# EAGLE design transmission end copy-1 (EAGLE 6.3)
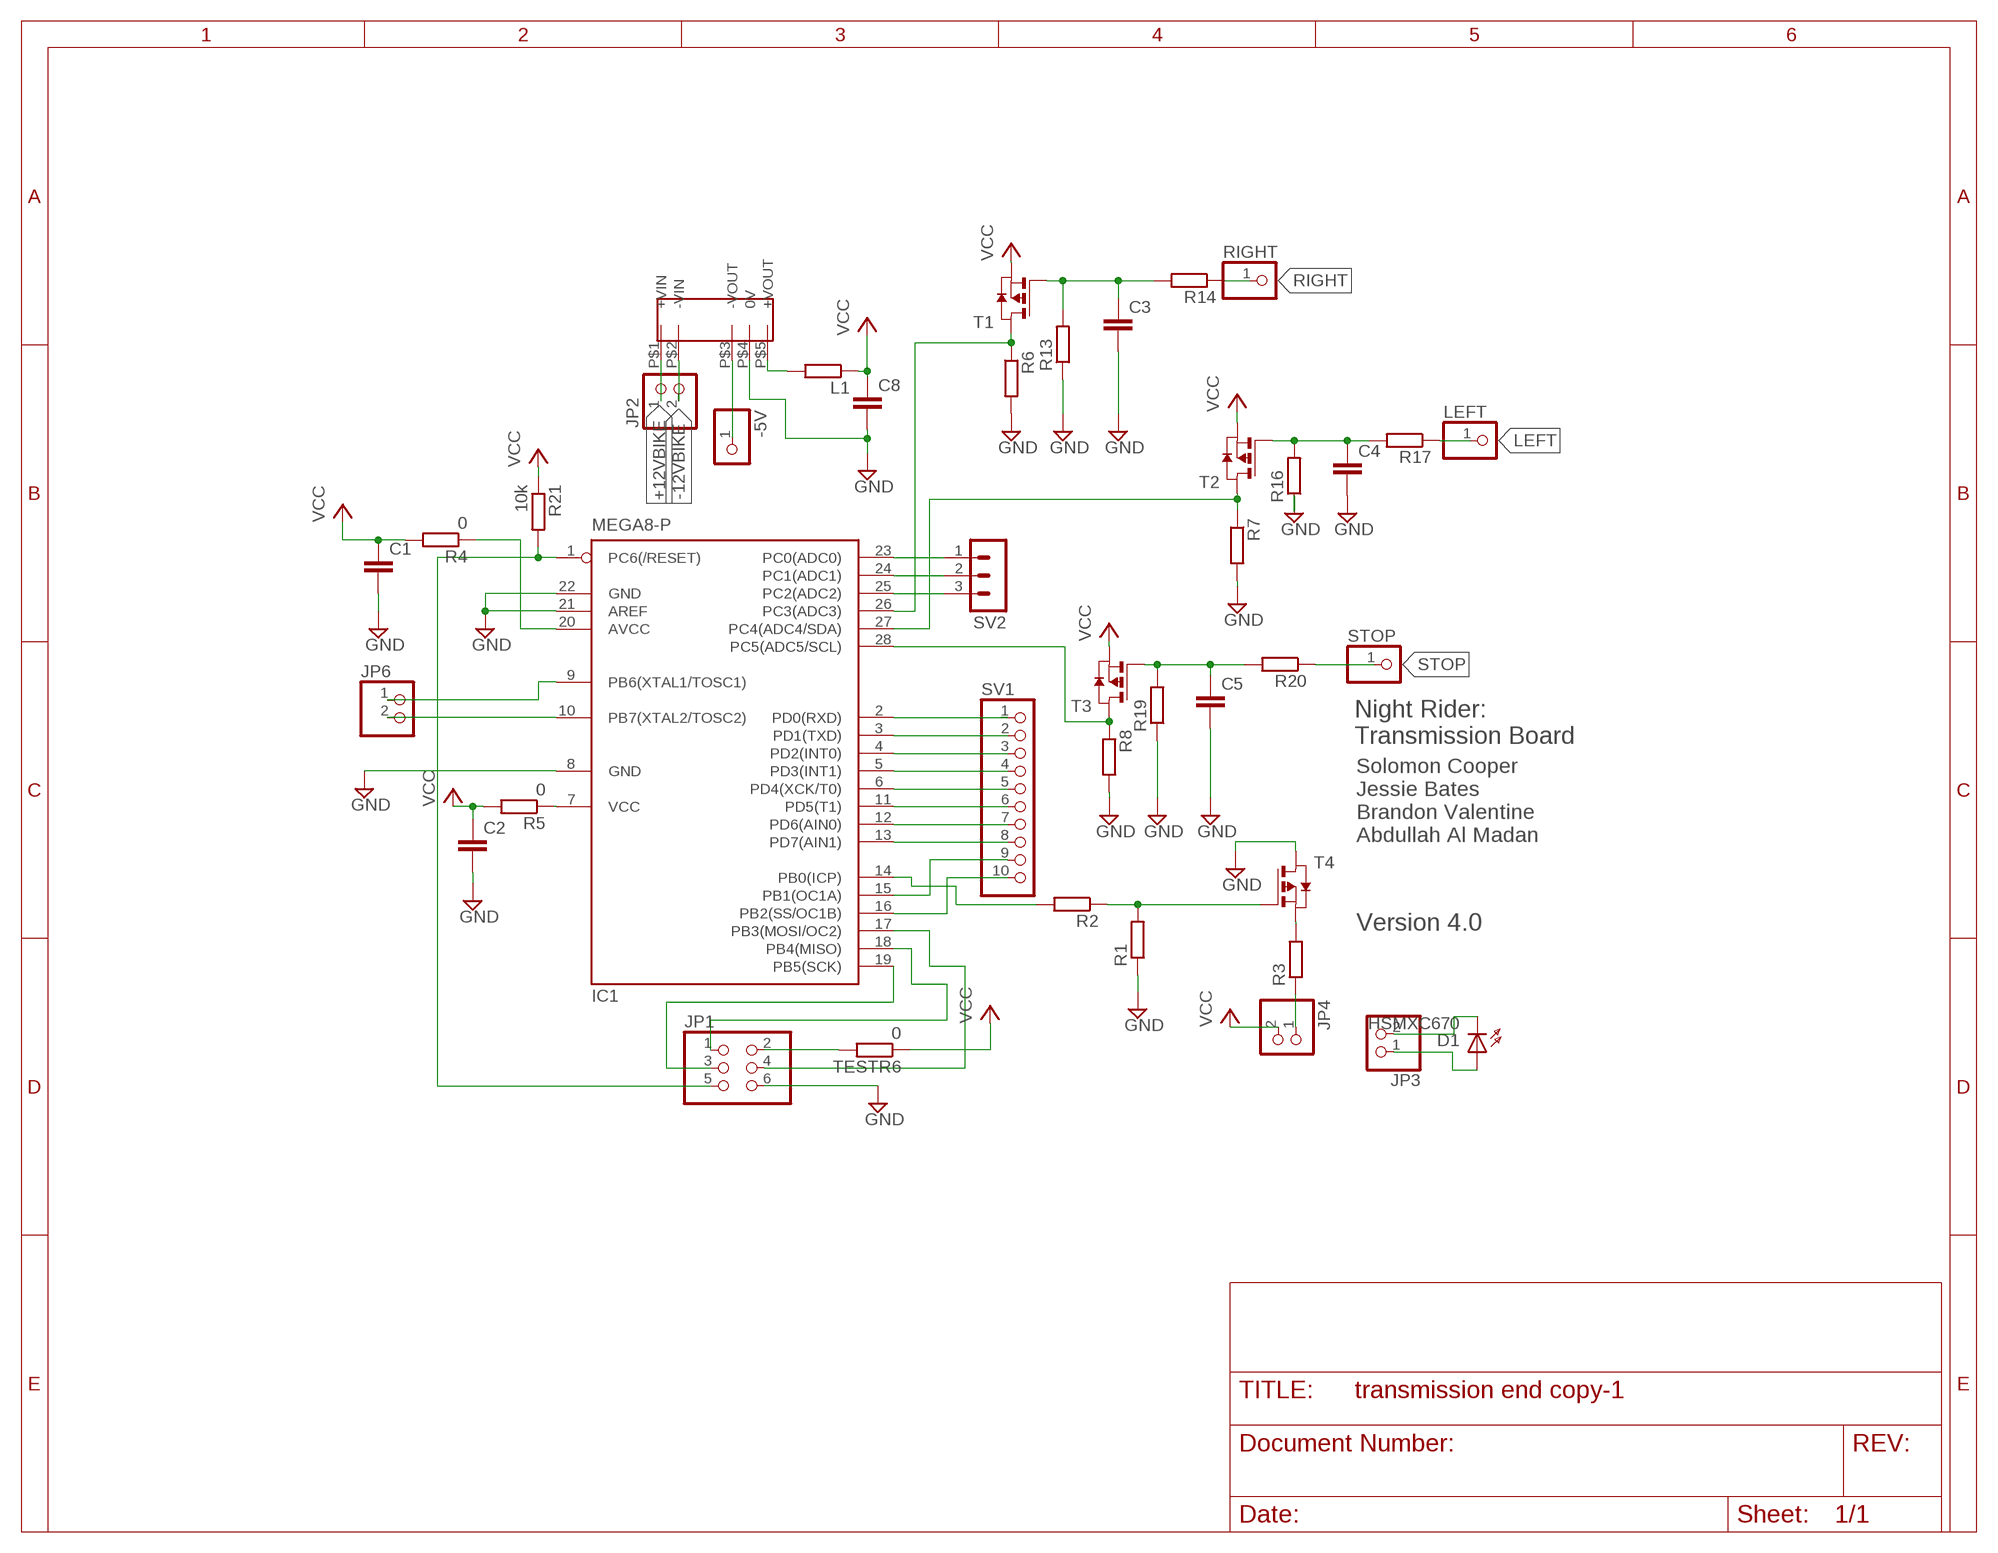
[diagram p0: schematic, sheet 1]

## Parts
-5V  PINHD-1X1  [1X01]
C1  C-EUC0805  [C0805]
C2  C-EUC0805  [C0805]
C3  C-EUC0805  [C0805]
C4  C-EUC0805  [C0805]
C5  C-EUC0805  [C0805]
C8  C-EUC0805  [C0805]
D1  HSMXC670  [HSMXC670]
IC1  MEGA8-P  [DIL28-3]
JP1  PINHD-2X3  [2X03]
JP2  PINHD-1X2  [1X02]
JP3  PINHD-1X2  [1X02]
JP4  PINHD-1X2  [1X02]
JP6  PINHD-1X2  [1X02]
L1  R-EU_M0805  [M0805]
LEFT  PINHD-1X1  [1X01]
R1  R-EU_M0805  [M0805]
R2  R-EU_M0805  [M0805]
R3  R-EU_M0805  [M0805]
R4  0  R-EU_M0805  [M0805]
R5  0  R-EU_M0805  [M0805]
R6  R-EU_M0805  [M0805]
R7  R-EU_M0805  [M0805]
R8  R-EU_M0805  [M0805]
R13  R-EU_M0805  [M0805]
R14  R-EU_M0805  [M0805]
R16  R-EU_M0805  [M0805]
R17  R-EU_M0805  [M0805]
R19  R-EU_M0805  [M0805]
R20  R-EU_M0805  [M0805]
R21  10k  R-EU_M0805  [M0805]
RIGHT  PINHD-1X1  [1X01]
STOP  PINHD-1X1  [1X01]
SV1  PINHD-1X10  [1X10]
SV2  MA03-1  [MA03-1]
T1  PMOSSOT23  [SOT-23]
T2  PMOSSOT23  [SOT-23]
T3  PMOSSOT23  [SOT-23]
T4  PMOSSOT23  [SOT-23]
TESTR6  0  R-EU_M0805  [M0805]
U$1  NKA1205SC  [NKA1205SC]

## Nets
+12VBIKE: JP2.1 U$1.P$1(+VIN)
-12VBIKE: JP2.2 U$1.P$2(-VIN)
GND: C1.2 C2.2 C3.2 C4.2 C5.2 C8.2 IC1.8(GND) IC1.21(AREF) IC1.22(GND) JP1.6 R1.1 R6.2 R7.2 R8.2 R13.1 R16.1 R19.1 T4.1(D) U$1.P$4(0V)
LEFT: LEFT.1 R17.1
N$1: IC1.2(PD0(RXD)) SV1.1
N$2: R1.2 R2.1 T4.3(G)
N$3: JP4.1 R3.1
N$4: IC1.27(PC4(ADC4/SDA)) R7.1 T2.1(D)
N$5: IC1.3(PD1(TXD)) SV1.2
N$6: R3.2 T4.2(S)
N$7: IC1.1(PC6(/RESET)) JP1.5 R21.2
N$8: IC1.14(PB0(ICP)) R2.2
N$9: L1.2 U$1.P$5(+VOUT)
N$10: IC1.4(PD2(INT0)) SV1.3
N$11: -5V.1 U$1.P$3(-VOUT)
N$12: IC1.9(PB6(XTAL1/TOSC1)) JP6.1
N$14: IC1.28(PC5(ADC5/SCL)) R8.1 T3.1(D)
N$15: IC1.5(PD3(INT1)) SV1.4
N$16: IC1.6(PD4(XCK/T0)) SV1.5
N$17: IC1.11(PD5(T1)) SV1.6
N$18: IC1.12(PD6(AIN0)) SV1.7
N$19: IC1.13(PD7(AIN1)) SV1.8
N$20: D1.K(C) JP3.2
N$21: IC1.15(PB1(OC1A)) SV1.9
N$22: IC1.16(PB2(SS/OC1B)) SV1.10
N$23: IC1.17(PB3(MOSI/OC2)) JP1.4
N$24: IC1.18(PB4(MISO)) JP1.1
N$25: IC1.19(PB5(SCK)) JP1.3
N$26: IC1.10(PB7(XTAL2/TOSC2)) JP6.2
N$27: IC1.23(PC0(ADC0)) SV2.1
N$28: IC1.24(PC1(ADC1)) SV2.2
N$29: IC1.25(PC2(ADC2)) SV2.3
N$30: IC1.26(PC3(ADC3)) R6.1 T1.1(D)
N$31: IC1.7(VCC) R5.1
N$32: IC1.20(AVCC) R4.1
N$33: JP1.2 TESTR6.2
N$34: C4.1 R16.2 R17.2 T2.3(G)
N$35: C3.1 R13.2 R14.2 T1.3(G)
N$36: D1.A JP3.1
N$37: C5.1 R19.2 R20.2 T3.3(G)
RIGHT: R14.1 RIGHT.1
STOP: R20.1 STOP.1
VCC: C1.1 C2.1 C8.1 JP4.2 L1.1 R4.2 R5.2 R21.1 T1.2(S) T2.2(S) T3.2(S) TESTR6.1

## Notes on the sheet
- Night Rider: 
  Transmission Board
- Solomon Cooper 
  Jessie Bates
  Brandon Valentine
  Abdullah Al Madan
- Version 4.0

## Library data of the parts
-5V LEFT RIGHT STOP = pinhead:PINHD-1X1: PIN HEADER
C1-C5 C8 = rcl:C-EU: CAPACITOR, European symbol
D1 = opto-transmittter-hp:HSMXC670: OPTO TRANSMITTER; OC_FARNELL: unknown; OC_NEWARK: unknown
IC1 = atmel:MEGA8-P: MICROCONTROLLER 8 Kbytes FLASH, 1 kbytes SRAM, 512 bytes EEPROM, USART, 4-channel 10 bit ADC, 2-channel 8 bit ADC Pin compatible with Atmega48, ATMega88, ATMega168 Source: avr.lbr; OC_FARNELL: unknown; OC_NEWARK: unknown
JP1 = pinhead:PINHD-2X3: PIN HEADER
JP2-JP4 JP6 = pinhead:PINHD-1X2: PIN HEADER
L1 R1-R8 R13 R14 R16 R17 R19-R21 TESTR6 = resistor:R-EU_: RESISTOR, European symbol
SV1 = pinhead:PINHD-1X10: PIN HEADER
SV2 = con-lstb:MA03-1: PIN HEADER; OC_FARNELL: unknown; OC_NEWARK: unknown
T1-T4 = zetex:PMOSSOT23: MOS FET; OC_FARNELL: unknown; OC_NEWARK: unknown
U$1 = nka1205sc:NKA1205SC

## Board
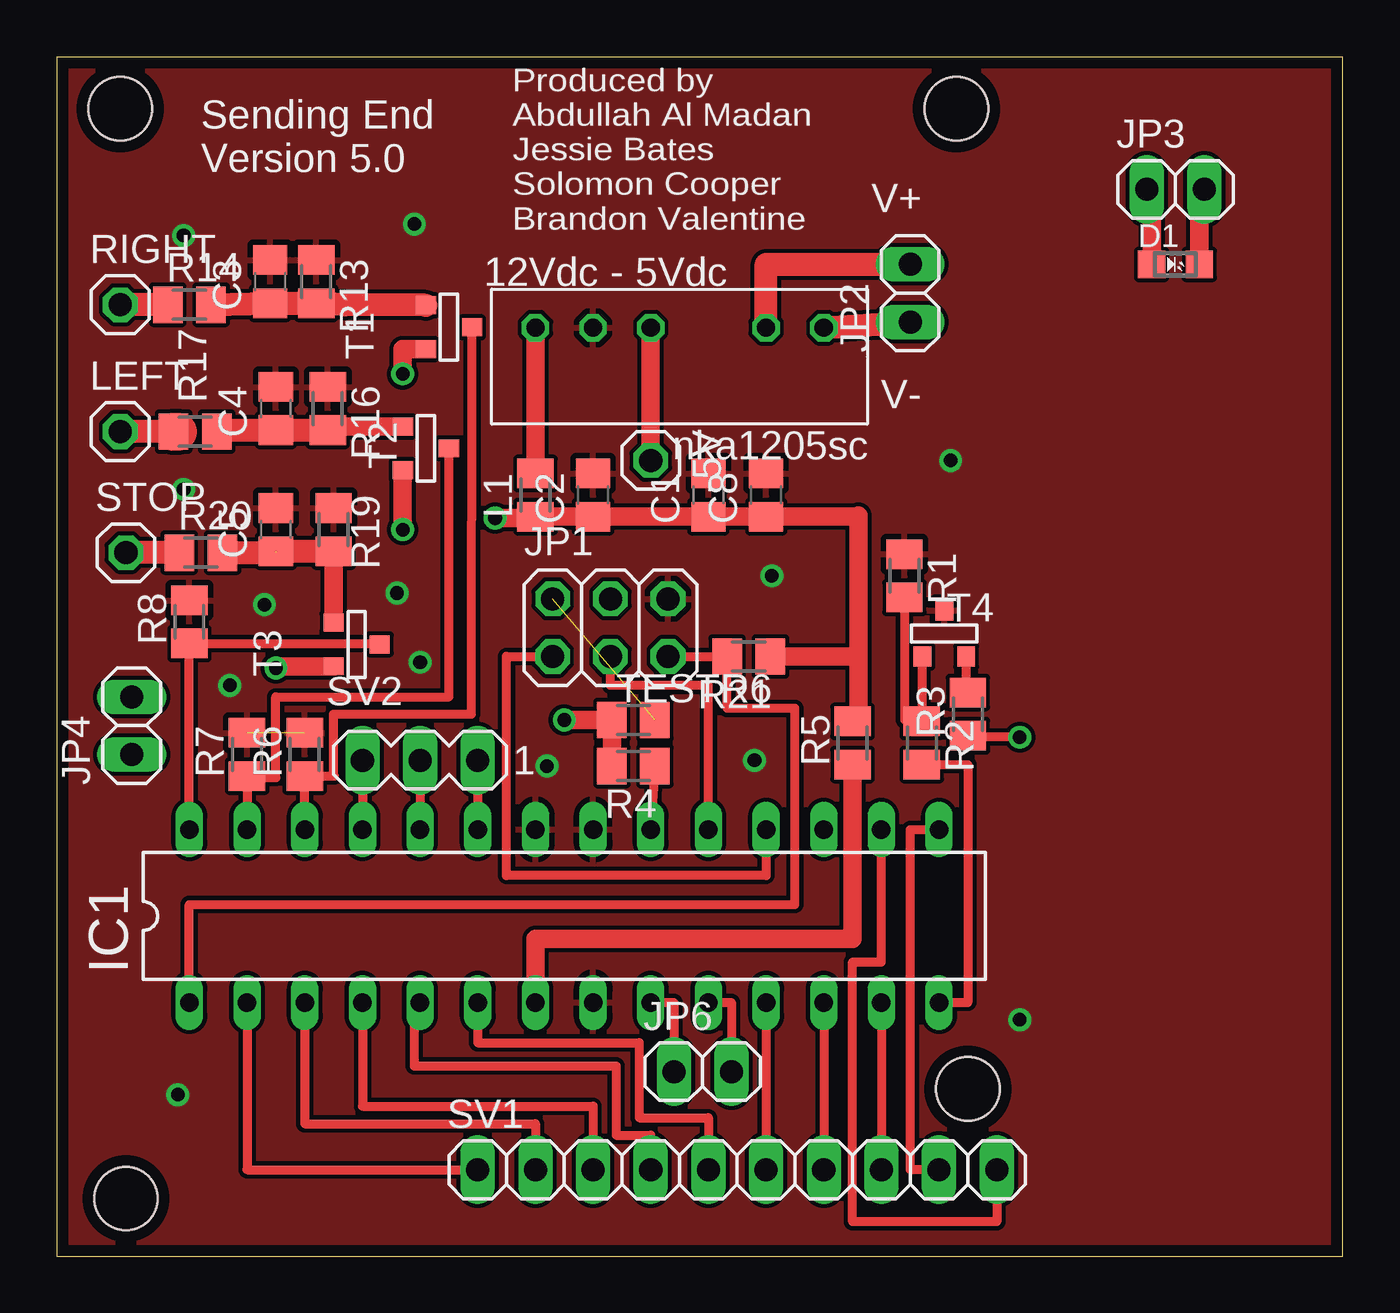
[diagram p1: board, top side]
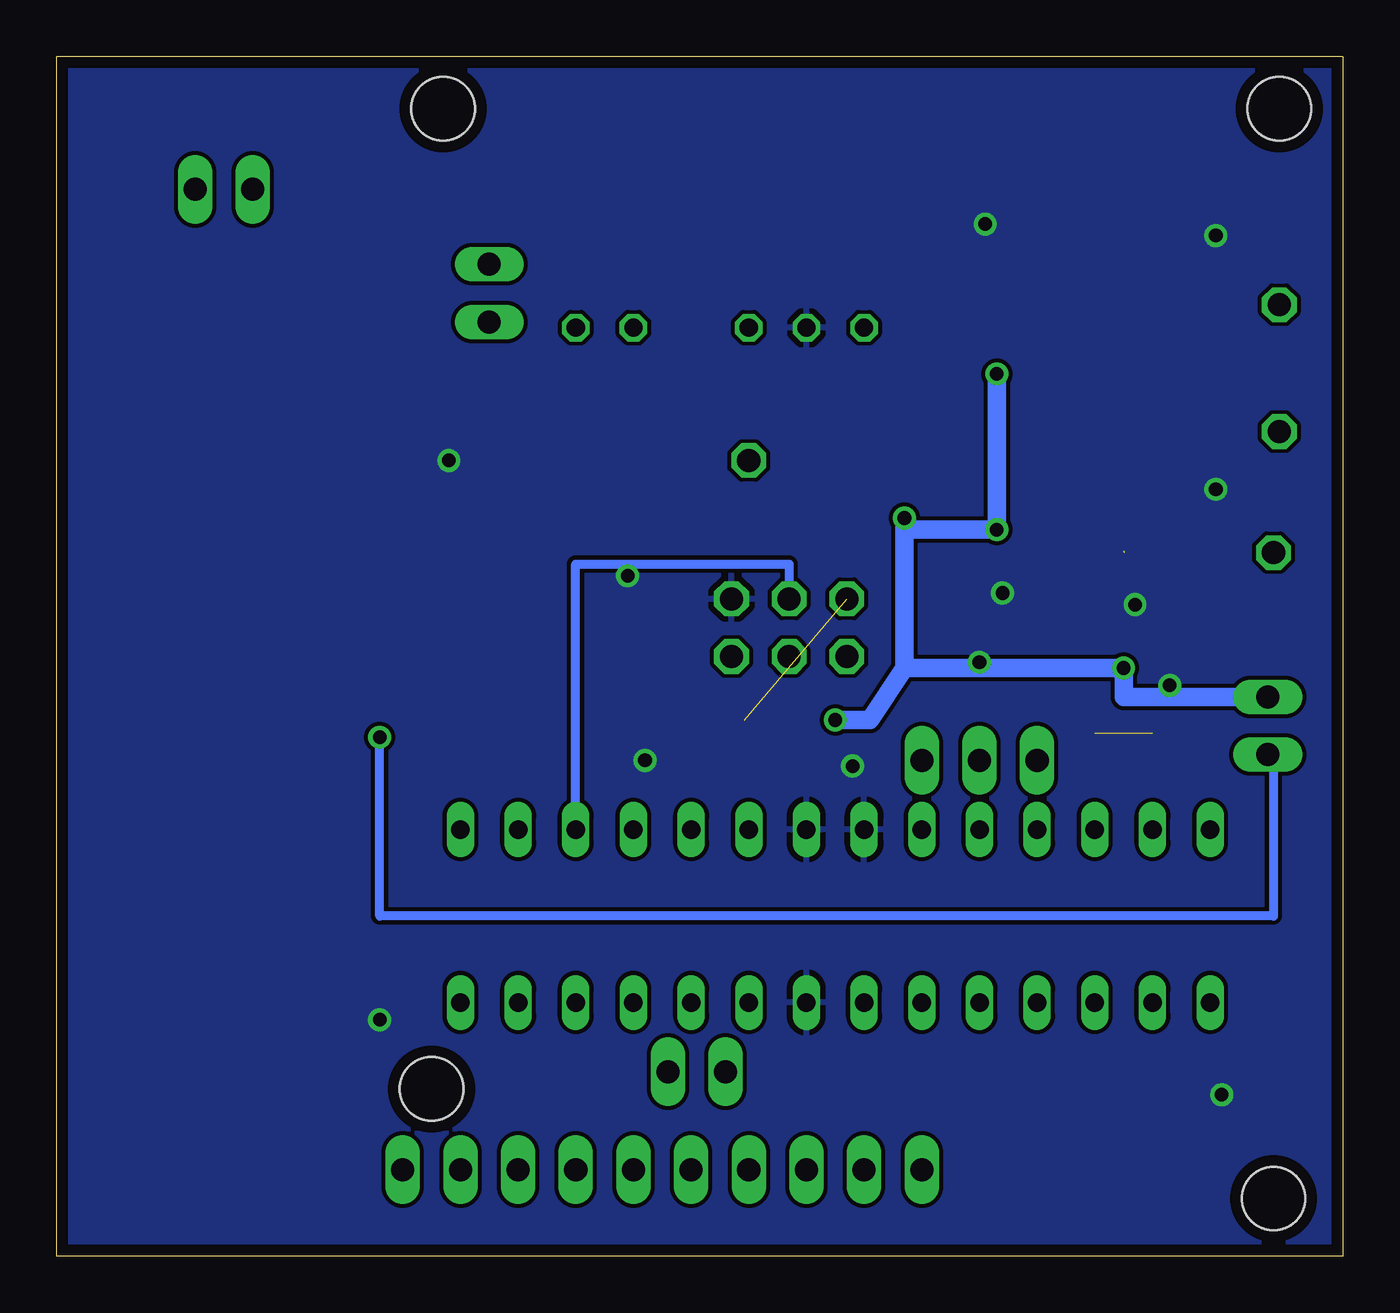
[diagram p2: board, bottom side, seen from below]

Size 56.64 x 52.83 mm. Coordinates in mm from the lower left corner, seen from the top.
Outline: 0,0 56.64,0 56.64,52.83 0,52.83 0,0
Copper layers (1*16): Top 0.0178mm / dielectric 59mil / Bottom 0.0178mm
Design rules "sunstone-valueproto": minimum track width 7mil, minimum drill 16mil, track to track 7mil, track to pad 7mil, pad to pad 7mil, via to via 7mil, smd to smd 7mil, copper to edge 20mil, drill to drill 16mil, minimum pad ring 8mil, minimum via ring 8mil, stop-mask expansion 3mil, vias tented up to drill 0mil, thermal gap 10mil
Holes 2.8 mm at 2.79,50.55 39.62,50.55 40.13,7.37 3.05,2.54

### Footprints (pad centres in the part's own frame; a part is rotated, then mirrored left to right if it is on the bottom)
1X01 = drill 1.016 octagon: 1 0,0
C0805 = smd 1.3 x 1.5: 1 -0.95,0; 2 0.95,0
HSMXC670 = smd 1.2 x 1.2: A -1.05,0; K 1.05,0
DIL28-3 = drill 0.813 long: 1 -16.51,-3.81; 2 -13.97,-3.81; 3 -11.43,-3.81; 4 -8.89,-3.81; 5 -6.35,-3.81; 6 -3.81,-3.81; 7 -1.27,-3.81; 8 1.27,-3.81; 9 3.81,-3.81; 10 6.35,-3.81; 11 8.89,-3.81; 12 11.43,-3.81; 13 13.97,-3.81; 14 16.51,-3.81; 15 16.51,3.81; 16 13.97,3.81; 17 11.43,3.81; 18 8.89,3.81; 19 6.35,3.81; 20 3.81,3.81; 21 1.27,3.81; 22 -1.27,3.81; 23 -3.81,3.81; 24 -6.35,3.81; 25 -8.89,3.81; 26 -11.43,3.81; 27 -13.97,3.81; 28 -16.51,3.81
2X03 = drill 1.016 octagon: 1 -2.54,-1.27; 2 -2.54,1.27; 3 0,-1.27; 4 0,1.27; 5 2.54,-1.27; 6 2.54,1.27
1X02 = drill 1.016 long: 1 -1.27,0; 2 1.27,0
M0805 = smd 1.3 x 1.6: 1 -0.95,0; 2 0.95,0
1X10 = drill 1.016 long: 1 -11.43,0; 2 -8.89,0; 3 -6.35,0; 4 -3.81,0; 5 -1.27,0; 6 1.27,0; 7 3.81,0; 8 6.35,0; 9 8.89,0; 10 11.43,0
MA03-1 = drill 1.016 long: 1 -2.54,0; 2 0,0; 3 2.54,0
SOT-23 = smd 0.787 x 0.889: 1 0.025,-1.016; 2 -0.94,1.016; 3 0.991,1.016
NKA1205SC = drill 0.8 octagon: P$1 -6.35,-1.27; P$2 -3.81,-1.27; P$3 1.27,-1.27; P$4 3.81,-1.27; P$5 6.35,-1.27

### Placement (x,y rotation side)
-5V  26.16,35.05 270 top
C1  28.7,33.53 90 top
C2  23.62,33.53 90 top
C3  9.4,42.93 90 top
C4  9.65,37.34 90 top
C5  9.65,32 90 top
C8  31.24,33.53 90 top
D1  49.28,43.69 0 top
IC1  22.35,14.99 0 top
JP1  24.38,27.69 0 top
JP2  37.59,42.42 90 top
JP3  49.28,46.99 0 top
JP4  3.3,23.37 90 top
JP6  28.45,8.13 0 top
L1  21.08,33.53 90 top
LEFT  2.79,36.32 0 top
R1  37.34,29.97 270 top
R2  38.1,22.61 270 top
R3  40.13,23.88 90 top
R4  25.4,21.59 180 top
R5  35.05,22.61 90 top
R6  10.92,22.1 90 top
R7  8.38,22.1 90 top
R8  5.84,27.94 90 top
R13  11.43,42.93 270 top
R14  5.84,41.91 0 top
R16  11.94,37.34 270 top
R17  6.1,36.32 0 top
R19  12.19,32 270 top
R20  6.35,30.99 0 top
R21  30.48,26.42 180 top
RIGHT  2.79,41.91 0 top
STOP  3.05,30.99 0 top
SV1  29.97,3.81 0 top
SV2  16,21.84 180 top
T1  17.27,40.89 90 top
T2  16.26,35.56 90 top
T3  13.21,26.92 90 top
T4  39.12,27.43 180 top
TESTR6  25.4,23.62 0 top
U$1  27.43,39.62 180 top

### Tracks (layer width: path | path; a pad name or v marks a point on that pad's centre or on a via)
+12VBIKE
  Top 1.016: U$1.P$1 JP2.1
-12VBIKE
  Top 1.016: U$1.P$2 31.24,43.69 JP2.2
GND  (via drill 0.6)  (1 unrouted)
  other vias: 15.75,45.47 14.99,29.21 9.14,28.7 31.5,29.97 39.37,35.05 5.33,7.11 30.73,21.84 21.59,21.59 16,26.16 42.42,10.41 7.62,25.15 5.59,33.78 5.59,44.96
  pour Bottom: 0,0 56.64,0 56.64,52.83 0,52.83
  pour Top: 0,0 56.64,0 56.64,52.83 0,52.83
LEFT
  Top 1.016: R17.1 LEFT.1
  Top 1.676: R17.1 5.33,36.32
N$1
  Top 0.406: IC1.2 8.38,3.81 SV1.1
N$2
  Top 0.406: T4.3 38.1,26.42 R2.1 38.1,23.62 37.34,23.62 R1.2
N$3  (via drill 0.6)
  Top 0.406: v42.42,22.86 40.13,22.86 R3.1
  Bottom 0.406: JP4.1 3.05,22.1 3.05,14.99 42.42,14.99 v42.42,22.86
N$4
  Top 0.406: IC1.27 R7.1 8.45,21.08 9.65,21.08 9.65,24.64 17.27,24.64 T2.1
N$5
  Top 0.406: IC1.3 10.92,5.84 21.08,5.84 SV1.2
N$6
  Top 0.406: R3.2 40.06,24.83 T4.2
N$7
  Top 0.406: JP1.5 R21.2 29.53,24.13 32.51,24.13 32.51,15.49 5.84,15.49 IC1.1
N$8
  Top 0.406: IC1.14 40.13,11.18 40.13,21.66 R2.2
N$9
  Top 0.813: U$1.P$5 L1.2
N$10
  Top 0.406: IC1.4 13.46,6.6 23.62,6.6 SV1.3
N$11
  Top 0.813: U$1.P$3 -5V.1
N$12
  Top 0.406: IC1.9 27.18,11.18 JP6.1
N$14
  Top 0.406: IC1.28 R8.1 14.22,26.99 T3.1
N$15
  Top 0.406: IC1.5 15.75,11.18 15.75,8.38 24.64,8.38 24.64,5.33 26.16,5.33 SV1.4
N$16
  Top 0.406: IC1.6 18.54,9.4 25.65,9.4 25.65,6.1 28.7,6.1 SV1.5
N$17
  Top 0.406: IC1.11 SV1.6
N$18
  Top 0.406: IC1.12 SV1.7
N$19
  Top 0.406: IC1.13 SV1.8
N$20
  Top 0.813: JP3.2 50.33,46.99 D1.K
N$21
  Top 0.406: SV1.9 37.59,3.81 37.59,18.8 IC1.15
N$22
  Top 0.406: SV1.10 41.4,1.52 35.05,1.52 35.05,12.95 36.32,12.95 IC1.16
N$23
  Bottom 0.406: IC1.17 33.78,30.48 24.38,30.48 JP1.4
N$24
  Top 0.406: IC1.18 31.24,16.76 19.81,16.76 19.81,26.42 JP1.1
N$25
  Top 0.406: IC1.19 28.7,25.15 24.38,25.15 JP1.3
N$26
  Top 0.406: IC1.10 29.72,11.18 JP6.2
N$27
  Top 0.406: SV2.1 IC1.23
N$28
  Top 0.406: SV2.2 IC1.24
N$29
  Top 0.406: SV2.3 IC1.25
N$30
  Top 0.406: IC1.26 R6.1 12.19,21.15 | 12.22,21.15 12.19,21.15 | 12.19,21.15 12.19,23.88 18.26,23.88 T1.1
N$31
  Top 0.813: IC1.7 21.08,13.97 35.05,13.97 R5.1
N$32
  Top 0.406: R4.1 IC1.20
N$33  (1 unrouted)
N$34
  Top 0.406: R17.2 7.11,36.39
  Top 0.813: T2.3 11.94,36.55 R16.2
  Top 1.016: 7.11,36.39 C4.1 R16.2
N$35
  Top 1.016: R14.2 C3.1 R13.2 12.7,41.91 T1.3
N$36
  Top 0.813: JP3.1 48.26,47.24 48.23,47.24 D1.A
N$37  (1 unrouted)
  Top 0.813: T3.3 R19.2
  Top 1.016: R20.2 9.65,30.99 | C5.1 R19.2
RIGHT
  Top 1.016: R14.1 RIGHT.1
STOP
  Top 1.016: R20.1 STOP.1
VCC  (via drill 0.6)
  Top 0.813: R4.2 TESTR6.1 v22.35,23.62 | R5.2 35.3,23.56 35.3,26.42 | 35.3,26.42 35.3,32.58 | 35.3,32.58 35.3,32.63 | T3.2 9.65,25.98 v9.65,25.91 | T2.2 v15.24,32 | T1.2 15.24,39.95 v15.24,38.86 | v19.3,32.51 21.08,32.51 L1.1 C2.1 C1.1 C8.1 35.3,32.58 | R21.1 35.3,26.42
  Bottom 0.813: v22.35,23.62 20.83,23.62 19.3,25.91 | 19.3,32 v19.3,32.51 | 19.3,25.91 v9.65,25.91 9.65,24.64 JP4.2 | 19.3,25.91 19.3,32 | 19.3,32 v15.24,32 v15.24,38.86

### Text on the board
tPlace: Sending End / Version 5.0 | V+ | Produced by / Abdullah Al Madan / Jessie Bates / Solomon Cooper / Brandon Valentine | V-